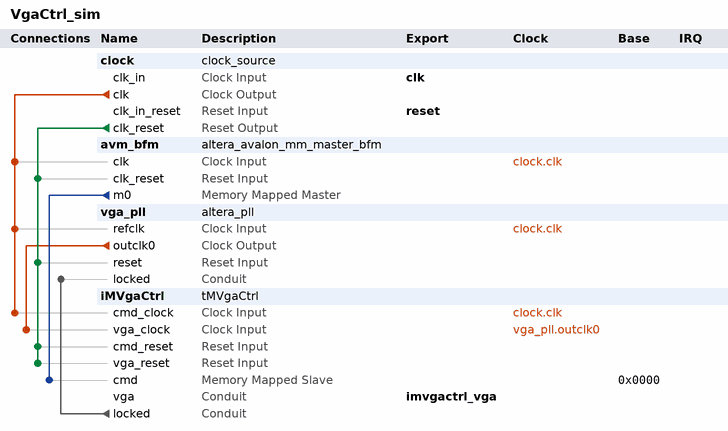
[diagram p0: system contents]
# Platform Designer (Qsys) system VgaCtrl_sim, Cyclone V 5CEBA2F17A7
# Parameters at their usual value, and those the tool derives, are not listed.
package require -exact qsys 16.0
create_system VgaCtrl_sim
set_project_property DEVICE_FAMILY {Cyclone V}
set_project_property DEVICE 5CEBA2F17A7

add_instance clock clock_source 16.0
set_instance_parameter_value clock clockFrequency 50000000
set_instance_parameter_value clock resetSynchronousEdges DEASSERT

add_instance avm_bfm altera_avalon_mm_master_bfm 16.0
set_instance_parameter_value avm_bfm ADDRESS_UNITS SYMBOLS
set_instance_parameter_value avm_bfm AV_ADDRESS_W 17
set_instance_parameter_value avm_bfm AV_ALWAYS_BURST_MAX_BURST 0
set_instance_parameter_value avm_bfm AV_BURSTCOUNT_W 16
set_instance_parameter_value avm_bfm AV_BURST_BNDR_ONLY 0
set_instance_parameter_value avm_bfm AV_BURST_LINEWRAP 0
set_instance_parameter_value avm_bfm AV_CONSTANT_BURST_BEHAVIOR 1
set_instance_parameter_value avm_bfm AV_FIX_READ_LATENCY 1
set_instance_parameter_value avm_bfm AV_MAX_PENDING_READS 1
set_instance_parameter_value avm_bfm AV_MAX_PENDING_WRITES 0
set_instance_parameter_value avm_bfm AV_NUMSYMBOLS 2
set_instance_parameter_value avm_bfm AV_READRESPONSE_W 8
set_instance_parameter_value avm_bfm AV_READ_WAIT_TIME 1
set_instance_parameter_value avm_bfm AV_REGISTERINCOMINGSIGNALS 1
set_instance_parameter_value avm_bfm AV_WRITERESPONSE_W 8
set_instance_parameter_value avm_bfm USE_BEGIN_BURST_TRANSFER 1
set_instance_parameter_value avm_bfm USE_BURSTCOUNT 1
set_instance_parameter_value avm_bfm USE_BYTE_ENABLE 1
set_instance_parameter_value avm_bfm USE_READ 1
set_instance_parameter_value avm_bfm USE_READ_DATA 1
set_instance_parameter_value avm_bfm USE_READ_DATA_VALID 1
set_instance_parameter_value avm_bfm USE_WAIT_REQUEST 1
set_instance_parameter_value avm_bfm VHDL_ID 0

add_instance vga_pll altera_pll 16.0
set_instance_parameter_value vga_pll gui_device_speed_grade 1
set_instance_parameter_value vga_pll gui_number_of_clocks 1
set_instance_parameter_value vga_pll gui_operation_mode direct
set_instance_parameter_value vga_pll gui_output_clock_frequency0 25.175644
set_instance_parameter_value vga_pll gui_pll_mode {Integer-N PLL}
set_instance_parameter_value vga_pll gui_reference_clock_frequency 50.0
set_instance_parameter_value vga_pll gui_use_locked true

add_instance iMVgaCtrl tMVgaCtrl 1.0

# connections
add_connection clock.clk avm_bfm.clk clock
add_connection clock.clk iMVgaCtrl.cmd_clock clock
add_connection clock.clk vga_pll.refclk clock
add_connection vga_pll.outclk0 iMVgaCtrl.vga_clock clock
add_connection clock.clk_reset avm_bfm.clk_reset reset
add_connection clock.clk_reset iMVgaCtrl.cmd_reset reset
add_connection clock.clk_reset iMVgaCtrl.vga_reset reset
add_connection clock.clk_reset vga_pll.reset reset
add_connection avm_bfm.m0 iMVgaCtrl.cmd avalon
set_connection_parameter_value avm_bfm.m0/iMVgaCtrl.cmd baseAddress 0x0000
add_connection iMVgaCtrl.locked vga_pll.locked conduit

# exported interfaces
add_interface clk clock sink
set_interface_property clk EXPORT_OF clock.clk_in
add_interface imvgactrl_vga conduit end
set_interface_property imvgactrl_vga EXPORT_OF iMVgaCtrl.vga
add_interface reset reset sink
set_interface_property reset EXPORT_OF clock.clk_in_reset

set_interconnect_requirement {$system} qsys_mm.clockCrossingAdapter HANDSHAKE
set_interconnect_requirement {$system} qsys_mm.enableEccProtection FALSE
set_interconnect_requirement {$system} qsys_mm.insertDefaultSlave FALSE
set_interconnect_requirement {$system} qsys_mm.maxAdditionalLatency 1

save_system VgaCtrl_sim.qsys
